# Altium project DriverV3.0.PrjPcb
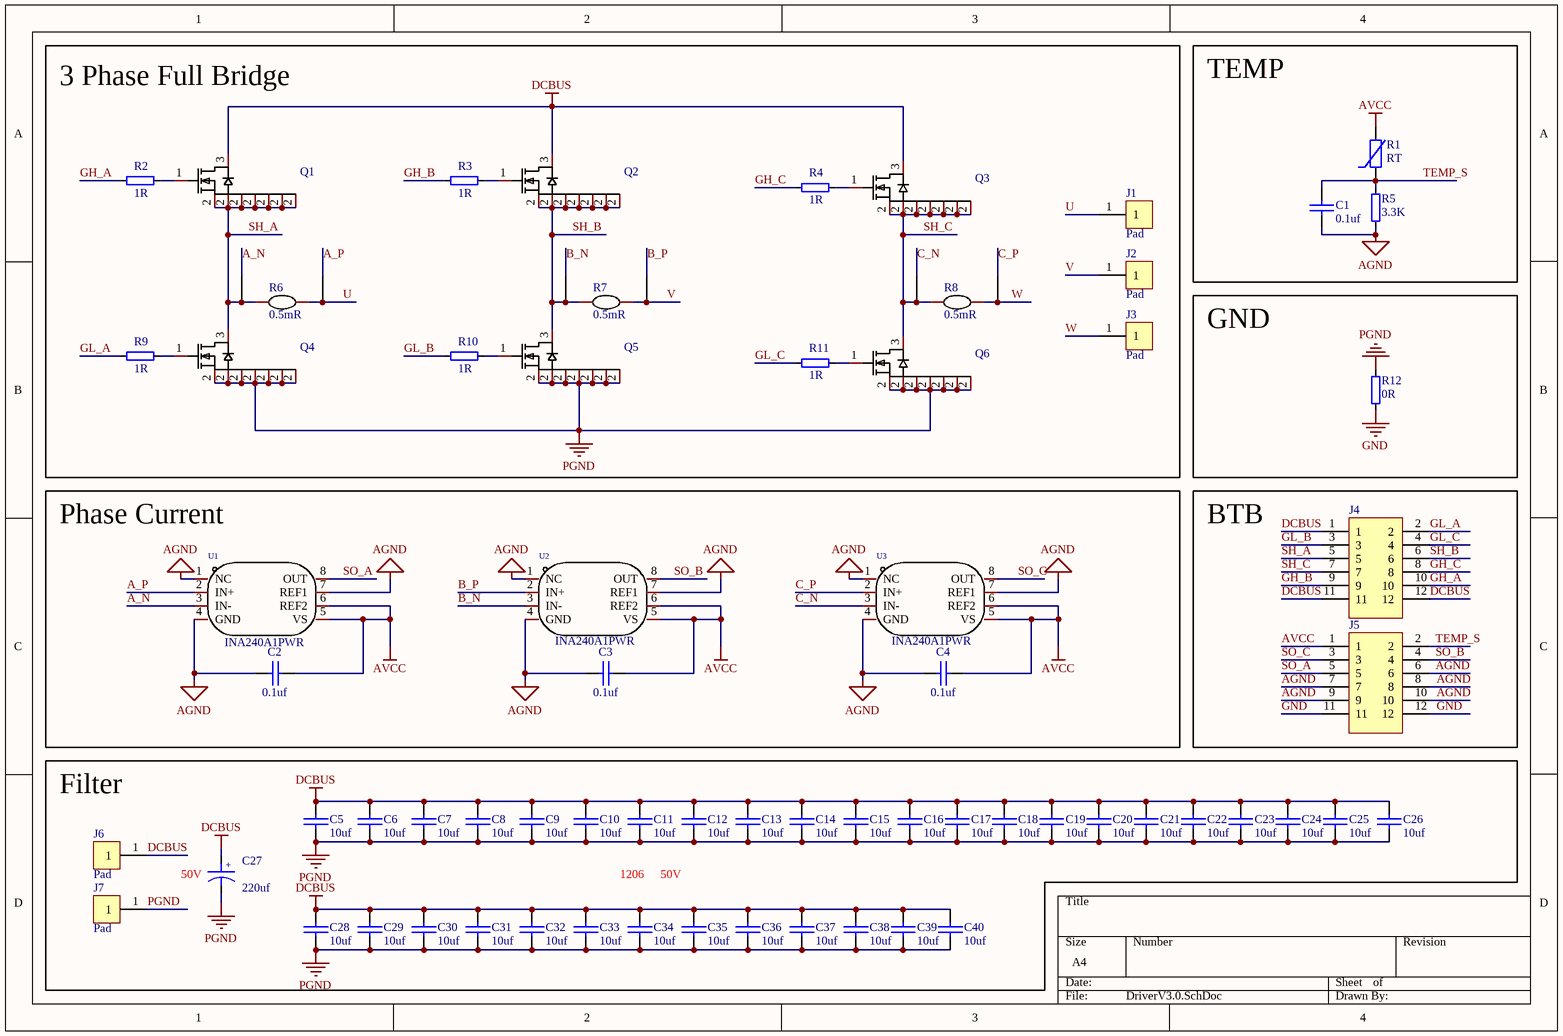
[diagram p0: DriverV3.0.SchDoc]
1 sheet, 74 parts. Net scope: global (net labels, ports and power ports of the same name join across sheets).
Board file: DriverV3.0.PcbDoc

## Sheet DriverV3.0.SchDoc
size A4; SheetNumber: 1; SheetTotal: 1

### Parts
C1  0.1uf  [C0603_S]
C2  0.1uf  [C0603_S]
C3  0.1uf  [C0603_S]
C4  0.1uf  [C0603_S]
C5  10uf  [1206C]
C6  10uf  [1206C]
C7  10uf  [1206C]
C8  10uf  [1206C]
C9  10uf  [1206C]
C10  10uf  [1206C]
C11  10uf  [1206C]
C12  10uf  [1206C]
C13  10uf  [1206C]
C14  10uf  [1206C]
C15  10uf  [1206C]
C16  10uf  [1206C]
C17  10uf  [1206C]
C18  10uf  [1206C]
C19  10uf  [1206C]
C20  10uf  [1206C]
C21  10uf  [1206C]
C22  10uf  [1206C]
C23  10uf  [1206C]
C24  10uf  [1206C]
C25  10uf  [1206C]
C26  10uf  [1206C]
C27  220uf  [ELECTRO10-5-N]
C28  10uf  [1206C]
C29  10uf  [1206C]
C30  10uf  [1206C]
C31  10uf  [1206C]
C32  10uf  [1206C]
C33  10uf  [1206C]
C34  10uf  [1206C]
C35  10uf  [1206C]
C36  10uf  [1206C]
C37  10uf  [1206C]
C38  10uf  [1206C]
C39  10uf  [1206C]
C40  10uf  [1206C]
J1  Pad  [PAD_RECT]
J2  Pad  [PAD_RECT]
J3  Pad  [PAD_RECT]
J4  BTB-2X6-M  [BTB-M-0.8mm-2x6P]  (value not drawn)
J5  BTB-2X6-M  [BTB-M-0.8mm-2x6P]  (value not drawn)
J6  Pad  [PAD_RECT]
J7  Pad  [PAD_RECT]
NT1  0.25mm  [Nettie10mil]  (value not drawn)  (net tie, no BOM)
NT2  0.25mm  [Nettie10mil]  (value not drawn)  (net tie, no BOM)
NT3  0.25mm  [Nettie10mil]  (value not drawn)  (net tie, no BOM)
NT4  0.25mm  [Nettie10mil]  (value not drawn)  (net tie, no BOM)
NT5  0.25mm  [Nettie10mil]  (value not drawn)  (net tie, no BOM)
NT6  0.25mm  [Nettie10mil]  (value not drawn)  (net tie, no BOM)
Q1  HYG006N04LS1TA  [TOLL]  (value not drawn)
Q2  HYG006N04LS1TA  [TOLL]  (value not drawn)
Q3  HYG006N04LS1TA  [TOLL]  (value not drawn)
Q4  HYG006N04LS1TA  [TOLL]  (value not drawn)
Q5  HYG006N04LS1TA  [TOLL]  (value not drawn)
Q6  HYG006N04LS1TA  [TOLL]  (value not drawn)
R1  RT  [R0603_S]
R2  1R  [R0603_S]
R3  1R  [R0603_S]
R4  1R  [R0603_S]
R5  3.3K  [R0603_S]
R6  0.5mR  [3920R]
R7  0.5mR  [3920R]
R8  0.5mR  [3920R]
R9  1R  [R0603_S]
R10  1R  [R0603_S]
R11  1R  [R0603_S]
R12  0R  [R0603_S]
U1  INA240A1PWR  [TSSOP-8]
U2  INA240A1PWR  [TSSOP-8]
U3  INA240A1PWR  [TSSOP-8]

### Blocks framed on the sheet
3 Phase Full Bridge: J1-J3 NT1-NT6 Q1-Q6 R2-R4 R6-R11
TEMP: C1 R1 R5
GND: R12
Phase Current: C2-C4 U1-U3
BTB: J4 J5
Filter: C5-C40 J6 J7

### Nets
AGND: C1.2 C2.1 C3.1 C4.1 J5.6 J5.7 J5.8 J5.9 J5.10 R5.1 U1.1(NC) U1.4(GND) U1.7(REF1) U2.1(NC) U2.4(GND) U2.7(REF1) U3.1(NC) U3.4(GND) U3.7(REF1)
AVCC: C2.2 C3.2 C4.2 J5.1 R1.2 U1.5(VS) U1.6(REF2) U2.5(VS) U2.6(REF2) U3.5(VS) U3.6(REF2)
DCBUS: C5.1 C6.1 C7.1 C8.1 C9.1 C10.1 C11.1 C12.1 C13.1 C14.1 C15.1 C16.1 C17.1 C18.1 C19.1 C20.1 C21.1 C22.1 C23.1 C24.1 C25.1 C26.1 C27.1 C28.1 C29.1 C30.1 C31.1 C32.1 C33.1 C34.1 C35.1 C36.1 C37.1 C38.1 C39.1 C40.1 J4.1 J4.11 J4.12 J6.1 Q1.3(D) Q2.3(D) Q3.3(D)
GND: J5.11 J5.12 R12.1
PGND: C5.2 C6.2 C7.2 C8.2 C9.2 C10.2 C11.2 C12.2 C13.2 C14.2 C15.2 C16.2 C17.2 C18.2 C19.2 C20.2 C21.2 C22.2 C23.2 C24.2 C25.2 C26.2 C27.2 C28.2 C29.2 C30.2 C31.2 C32.2 C33.2 C34.2 C35.2 C36.2 C37.2 C38.2 C39.2 C40.2 J7.1 Q4.2(S) Q5.2(S) Q6.2(S) R12.2
A_N: NT1.2 U1.3(IN-)
A_P: NT2.2 U1.2(IN+)
B_N: NT3.2 U2.3(IN-)
B_P: NT4.2 U2.2(IN+)
C_N: NT5.2 U3.3(IN-)
C_P: NT6.2 U3.2(IN+)
GH_A: J4.10 R2.1
GH_B: J4.9 R3.1
GH_C: J4.8 R4.1
GL_A: J4.2 R9.1
GL_B: J4.3 R10.1
GL_C: J4.4 R11.1
SH_A: J4.5 NT1.1 Q1.2(S) Q4.3(D) R6.1
SH_B: J4.6 NT3.1 Q2.2(S) Q5.3(D) R7.1
SH_C: J4.7 NT5.1 Q3.2(S) Q6.3(D) R8.1
SO_A: J5.5 U1.8(OUT)
SO_B: J5.4 U2.8(OUT)
SO_C: J5.3 U3.8(OUT)
TEMP_S: C1.1 J5.2 R1.1 R5.2
U: J1.1 NT2.1 R6.2
V: J2.1 NT4.1 R7.2
W: J3.1 NT6.1 R8.2
NetQ1_1: Q1.1(G) R2.2
NetQ2_1: Q2.1(G) R3.2
NetQ3_1: Q3.1(G) R4.2
NetQ4_1: Q4.1(G) R9.2
NetQ5_1: Q5.1(G) R10.2
NetQ6_1: Q6.1(G) R11.2

### Notes on the sheet
- (near C27) 50V
- 1206
- 50V
- (in symbol CAP+) +

### Library data of the parts
C1-C26 C28-C40 = CAP: 贴片电容
C27 = CAP+: 极性电容
J1-J3 J6 J7 = Pad: 焊盘
J4 J5 = BTB-2X6-M: 0.8间距2x6P公座
NT1-NT6 = NetTie_10mil
Q1-Q6 = HYG006N04LS1TA: N沟道增强型MOS 40V-600A; Manufacturer: HUAYI(华羿微); Add into BOM: yes; Type: N沟道; Drain Source Voltage (Vdss): 40V; Continuous Drain Current (Id): 600A; Power Dissipation (Pd): 428W; Drain Source On Resistance (RDS(on)@Vgs,Id): 0.45mΩ@10V,80A; Gate Threshold Voltage (Vgs(th)@Id): 1.8V@250uA; Total Gate Charge (Qg@Vgs): 230nC@10V; Input Capacitance (Ciss@Vds): 15.4nF@25V; Reverse Transfer Capacitance (Crss@Vds): 115pF@25V; Symbol: HYG006N04LS1TA; Device: HYG006N04LS1TA; LCSC Part Name: N沟道 40V 600A; Supplier Part: C2982928; Manufacturer Part: HYG006N04LS1TA; Supplier Footprint: TOLL; JLCPCB Part Class: 扩展库; Datasheet: https://atta.szlcsc.com/upload/public/pdf/source/20220321/91BDC8248F772C15069ACBA52C025F8E.pdf; Supplier: LCSC; Convert to PCB: yes; Operating Temperature: -55℃~+175℃@(Tj)
R1 = RT: 热敏电阻 NCP18XH103F03RB
R2-R5 R9-R12 = RES: 贴片电阻
R6-R8 = HoLRS3920: 采样电阻; Manufacturer: RESI(开步睿思）; Symbol: SEWF3920F1L00P9; Value: 1mΩ; Add into BOM: yes; Tolerance: ±1%; Power(Watts): 8W; Temperature Coefficient: ±25ppm/℃; Mounting Sytle: 贴片; Device: SEWF3920F1L00P9; Supplier: LCSC; Supplier Part: C5224161; Manufacturer Part: SEWF3920F1L00P9; JLCPCB Part Class: 扩展库; LCSC Part Name: 1mΩ ±1% 8W; Supplier Footprint: 3920; Datasheet: https://atta.szlcsc.com/upload/public/pdf/source/20231123/B35E1474215435358D1EA89A1F2CD565.pdf; Convert to PCB: yes; Type: 采样电阻
U1-U3 = INA240A1PWR: Manufacturer: TI(德州仪器); Add into BOM: yes; Number of Channels: 1; Supply Current: 1.8mA; Symbol: INA240A1PWR; Device: INA240A1PWR; Supplier: LCSC; Manufacturer Part: INA240A1PWR; Supplier Part: C93965; JLCPCB Part Class: 扩展库; LCSC Part Name: INA240A1PWR; Supplier Footprint: TSSOP-8; Datasheet: https://www.ti.com/cn/lit/gpn/ina240; Convert to PCB: yes; Operating Temperature: -40℃~+125℃; Name: INA240A1PWR